# EasyEDA schematic SCH_fig1_2021-11-24.json
TITLE: Sheet_1; REV: 1.0; Date: 2021-11-23; Sheet: 1/1; Drawn By: huseyin34; Company: Your Company
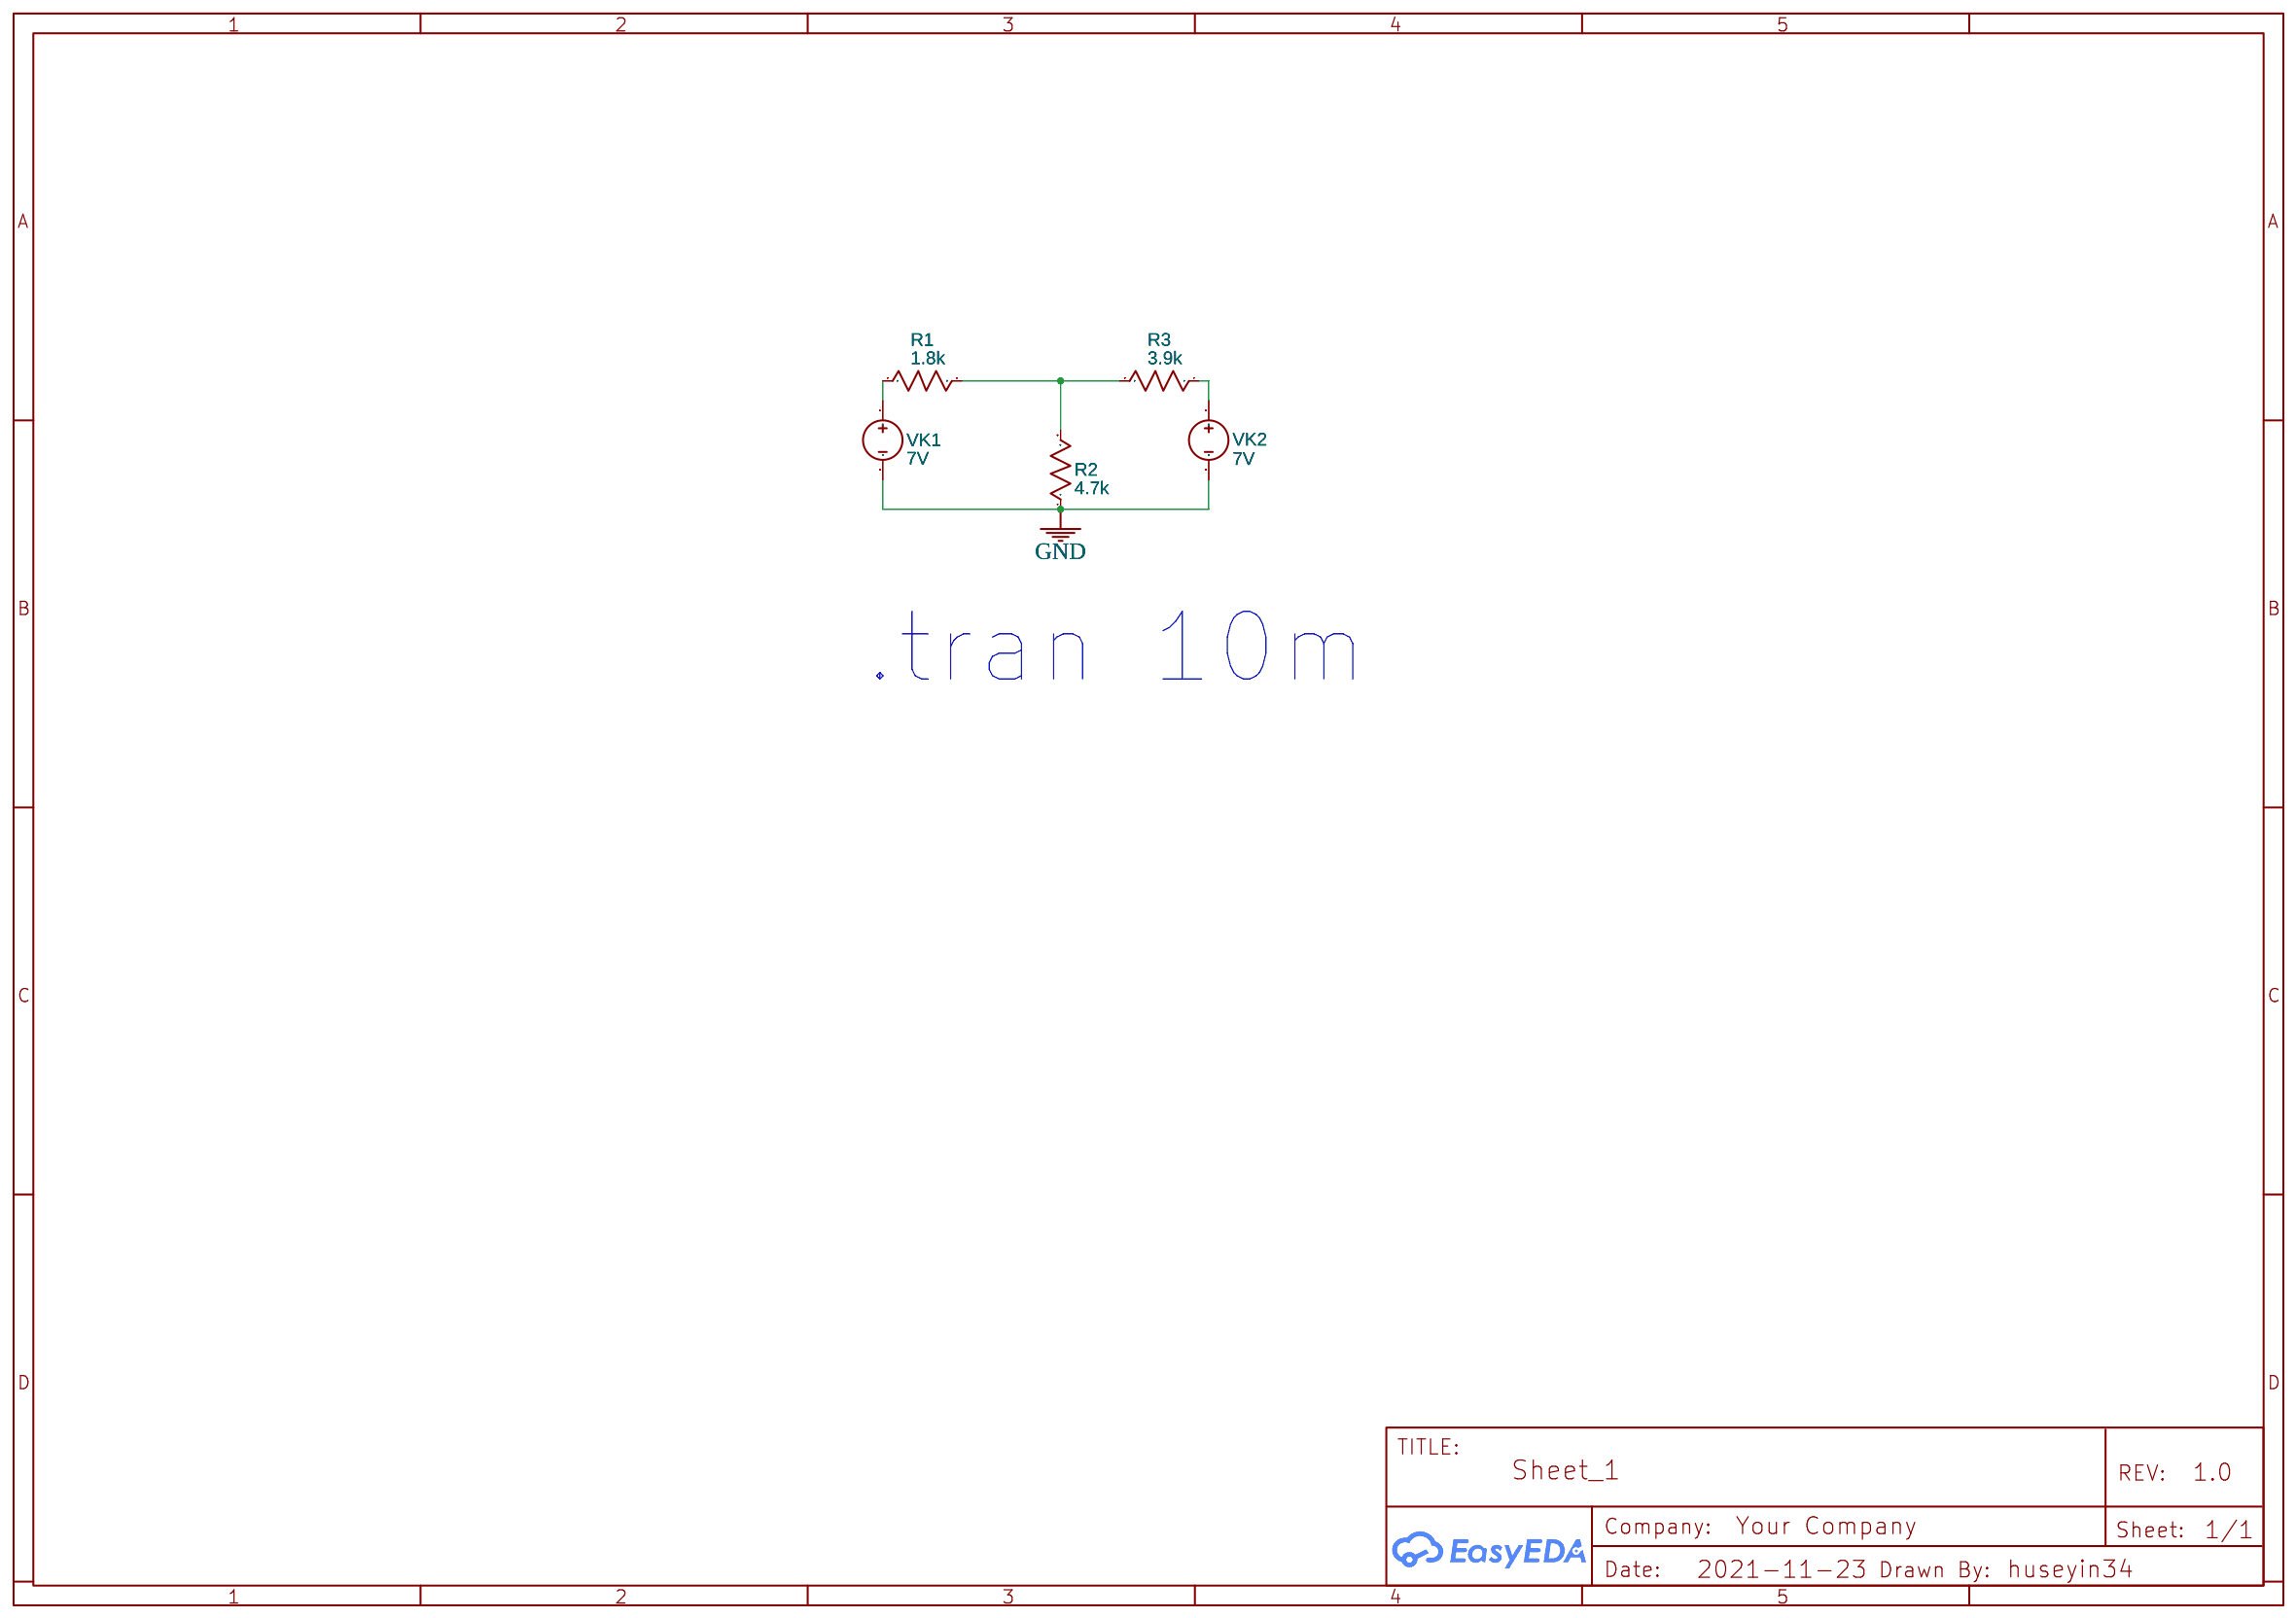
[diagram p0: schematic sheet]

## Parts
R1  1.8k  [AXIAL-0.3]
R2  4.7k  [AXIAL-0.3]
R3  3.9k  [AXIAL-0.3]
VK1  7V  [HDR1X2]
VK2  7V  [HDR1X2]

## Library data of the parts
R1-R3 = Resistor_US: Resistance: 1k; Contributor: EasyEDA; Supplier: YUJING
VK1 VK2 = VDC: Contributor: EasyEDA; sim: true

## Nets
GND: R2.1 VK1.2 VK2.2
Net-(R1-1): R1.1 VK1.1
Net-(R1-2): R1.2 R2.2 R3.2
Net-(R3-1): R3.1 VK2.1

## Notes on the sheet
- .tran 10m
